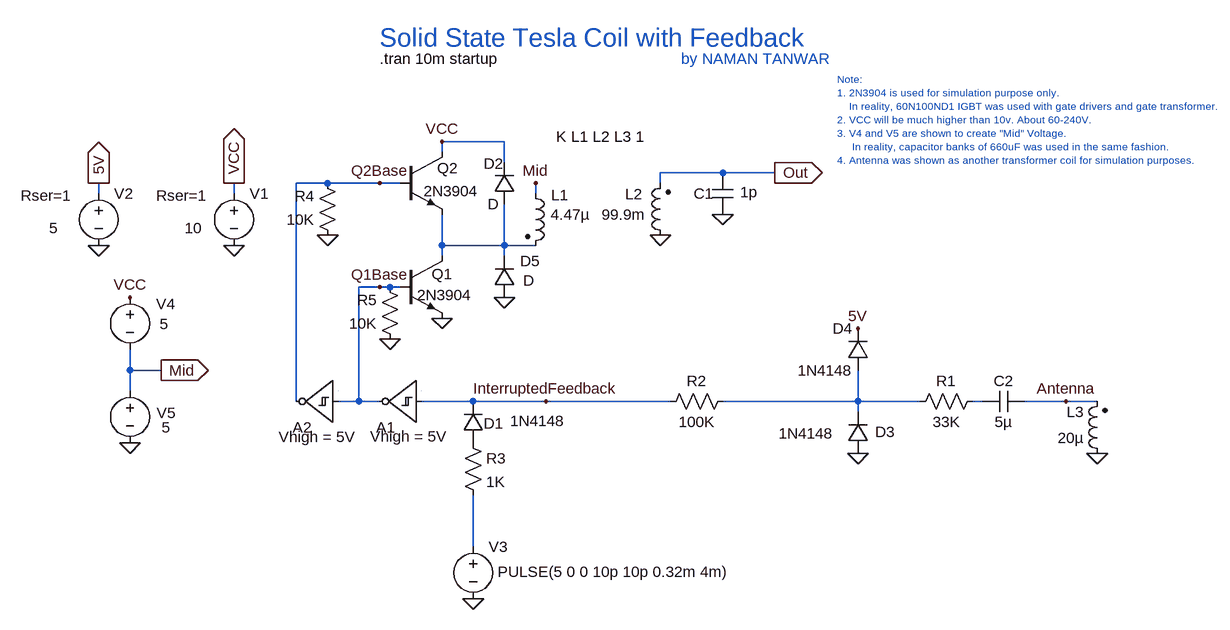
[diagram p0: schematic Feedback tesla coil.asc]
Feedback tesla coil.asc, the LTspice schematic file:
Version 4
SHEET 1 2112 932
WIRE 80 16 -16 16
WIRE -16 32 -16 16
WIRE 80 48 80 16
WIRE 416 64 320 64
WIRE 496 64 416 64
WIRE -192 80 -240 80
WIRE -112 80 -192 80
WIRE -80 80 -112 80
WIRE 320 80 320 64
WIRE -544 96 -544 80
WIRE -336 96 -336 80
WIRE 128 96 128 80
WIRE -16 176 -16 128
WIRE 80 176 80 112
WIRE 80 176 -16 176
WIRE 128 176 80 176
WIRE -16 192 -16 176
WIRE 80 192 80 176
WIRE -112 240 -144 240
WIRE -96 240 -112 240
WIRE -80 240 -96 240
WIRE -496 368 -496 336
WIRE -448 368 -496 368
WIRE -496 400 -496 368
WIRE -240 416 -240 80
WIRE -144 416 -144 240
WIRE -144 416 -176 416
WIRE -112 416 -144 416
WIRE 32 416 -48 416
WIRE 144 416 32 416
WIRE 336 416 144 416
WIRE 624 416 624 368
WIRE 624 416 416 416
WIRE 720 416 624 416
WIRE 816 416 800 416
WIRE 944 416 880 416
WIRE 992 416 944 416
WIRE 624 432 624 416
WIRE 32 640 32 560
FLAG -336 176 0
FLAG -16 288 0
FLAG 416 128 0
FLAG 320 160 0
FLAG 992 496 0
FLAG -336 80 VCC
IOPIN -336 80 Out
FLAG -16 16 VCC
FLAG 624 496 0
FLAG 624 304 5V
FLAG -544 176 0
FLAG -544 80 5V
IOPIN -544 80 Out
FLAG 32 720 0
FLAG -496 256 VCC
FLAG -496 480 0
FLAG -448 368 Mid
IOPIN -448 368 Out
FLAG 128 80 Mid
FLAG 496 64 Out
IOPIN 496 64 Out
FLAG -112 80 Q2Base
FLAG -112 240 Q1Base
FLAG 944 416 Antenna
FLAG 144 416 InterruptedFeedback
FLAG -192 160 0
FLAG -96 320 0
FLAG 80 256 0
SYMBOL voltage -336 80 R0
WINDOW 3 -76 69 Left 2
WINDOW 123 0 0 Left 0
WINDOW 39 -120 19 Left 2
SYMATTR Value 10
SYMATTR SpiceLine Rser=1
SYMATTR InstName V1
SYMBOL ind2 112 80 R0
WINDOW 0 40 18 Left 2
WINDOW 3 39 48 Left 2
SYMATTR InstName L1
SYMATTR Value 4.47µ
SYMATTR Type ind
SYMBOL ind2 336 176 R180
WINDOW 0 43 79 Left 2
WINDOW 3 39 48 Left 2
SYMATTR InstName L2
SYMATTR Value 99.9m
SYMATTR Type ind
SYMBOL npn -80 192 R0
WINDOW 0 48 28 Left 2
WINDOW 3 26 60 Left 2
SYMATTR InstName Q1
SYMATTR Value 2N3904
SYMBOL cap 400 64 R0
WINDOW 0 -29 32 Left 2
WINDOW 3 43 30 Left 2
SYMATTR InstName C1
SYMATTR Value 1p
SYMBOL ind2 1008 512 R180
WINDOW 0 36 80 Left 2
WINDOW 3 36 40 Left 2
SYMATTR InstName L3
SYMATTR Value 20µ
SYMATTR Type ind
SYMBOL npn -80 32 R0
WINDOW 0 57 25 Left 2
WINDOW 3 36 60 Left 2
SYMATTR InstName Q2
SYMATTR Value 2N3904
SYMBOL Digital\\schmtinv -48 480 R180
WINDOW 3 -40 10 Left 2
SYMATTR Value Vhigh = 5V
SYMATTR InstName A1
SYMBOL Digital\\schmtinv -176 480 R180
WINDOW 3 -27 9 Left 2
SYMATTR Value Vhigh = 5V
SYMATTR InstName A2
SYMBOL cap 880 400 R90
WINDOW 0 0 32 VBottom 2
WINDOW 3 32 32 VTop 2
SYMATTR InstName C2
SYMATTR Value 5µ
SYMBOL res 816 400 R90
WINDOW 0 0 56 VBottom 2
WINDOW 3 32 56 VTop 2
SYMATTR InstName R1
SYMATTR Value 33K
SYMBOL diode 640 496 R180
WINDOW 0 -41 33 Left 2
WINDOW 3 53 31 Left 2
SYMATTR InstName D3
SYMATTR Value 1N4148
SYMATTR Description Zener Diode
SYMATTR Type zener
SYMBOL diode 640 368 R180
WINDOW 0 24 64 Left 2
WINDOW 3 24 0 Left 2
SYMATTR InstName D4
SYMATTR Value 1N4148
SYMATTR Description Zener Diode
SYMATTR Type zener
SYMBOL res 432 400 R90
WINDOW 0 0 56 VBottom 2
WINDOW 3 32 56 VTop 2
SYMATTR InstName R2
SYMATTR Value 100K
SYMBOL voltage -544 80 R0
WINDOW 3 -76 69 Left 2
WINDOW 123 0 0 Left 0
WINDOW 39 -120 19 Left 2
SYMATTR Value 5
SYMATTR SpiceLine Rser=1
SYMATTR InstName V2
SYMBOL voltage 32 624 R0
WINDOW 123 0 0 Left 0
WINDOW 39 0 0 Left 0
WINDOW 3 38 54 Left 2
SYMATTR Value PULSE(5 0 0 10p 10p 0.32m 4m)
SYMATTR InstName V3
SYMBOL diode 48 480 R180
WINDOW 0 -31 30 Left 2
WINDOW 3 -126 34 Left 2
SYMATTR InstName D1
SYMATTR Value 1N4148
SYMBOL res 16 464 R0
SYMATTR InstName R3
SYMATTR Value 1K
SYMBOL voltage -496 240 R0
WINDOW 0 40 26 Left 2
WINDOW 3 46 57 Left 2
WINDOW 123 0 0 Left 0
WINDOW 39 0 0 Left 0
SYMATTR InstName V4
SYMATTR Value 5
SYMBOL voltage -496 384 R0
WINDOW 0 41 50 Left 2
WINDOW 3 49 72 Left 2
WINDOW 123 0 0 Left 0
WINDOW 39 0 0 Left 0
SYMATTR InstName V5
SYMATTR Value 5
SYMBOL res -176 176 R180
WINDOW 0 36 76 Left 2
WINDOW 3 36 40 Left 2
SYMATTR InstName R4
SYMATTR Value 10K
SYMBOL res -80 336 R180
WINDOW 0 36 76 Left 2
WINDOW 3 36 40 Left 2
SYMATTR InstName R5
SYMATTR Value 10K
SYMBOL diode 96 112 R180
WINDOW 0 17 62 Left 2
WINDOW 3 24 0 Left 2
SYMATTR InstName D2
SYMBOL diode 96 256 R180
WINDOW 0 -39 56 Left 2
WINDOW 3 -30 26 Left 2
SYMATTR InstName D5
TEXT -112 -112 Left 2 !.tran 10m startup
TEXT 160 8 Left 2 !K L1 L2 L3 1
TEXT -112 -144 Left 4 ;Solid State Tesla Coil with Feedback
TEXT 352 -112 Left 2 ;by NAMAN TANWAR
TEXT 592 -80 Left 1 ;Note:\n1. 2N3904 is used for simulation purpose only. \n    In reality, 60N100ND1 IGBT was used with gate drivers and gate transformer.\n2. VCC will be much higher than 10v. About 60-240V.\n3. V4 and V5 are shown to create "Mid" Voltage.\n     In reality, capacitor banks of 660uF was used in the same fashion.\n4. Antenna was shown as another transformer coil for simulation purposes.

The netlist it stands for:
* Feedback tesla coil.asc
V1 VCC 0 10 Rser=1
L1 Mid N001 4.47µ
L2 0 Out 99.9m
Q1 N001 Q1Base 0 0 2N3904
C1 Out 0 1p
L3 0 Antenna 20µ
Q2 VCC Q2Base N001 0 2N3904
A1 InterruptedFeedback 0 0 0 0 Q1Base 0 0 SCHMITT Vhigh = 5V
A2 Q1Base 0 0 0 0 Q2Base 0 0 SCHMITT Vhigh = 5V
C2 Antenna N003 5µ
R1 N003 N002 33K
D3 0 N002 1N4148
D4 N002 5V 1N4148
R2 N002 InterruptedFeedback 100K
V2 5V 0 5 Rser=1
V3 N004 0 PULSE(5 0 0 10p 10p 0.32m 4m)
D1 P001 InterruptedFeedback 1N4148
R3 P001 N004 1K
V4 VCC Mid 5
V5 Mid 0 5
R4 0 Q2Base 10K
R5 0 Q1Base 10K
D2 N001 VCC D
D5 0 N001 D
.model D D
.lib standard.dio
.model NPN NPN
.model PNP PNP
.lib standard.bjt
.tran 10m startup
K L1 L2 L3 1
* Solid State Tesla Coil with Feedback
* by NAMAN TANWAR
* Note:
* 1. 2N3904 is used for simulation purpose only.
*     In reality, 60N100ND1 IGBT was used with gate drivers and gate transformer.
* 2. VCC will be much higher than 10v. About 60-240V.
* 3. V4 and V5 are shown to create "Mid" Voltage.
*      In reality, capacitor banks of 660uF was used in the same fashion.
* 4. Antenna was shown as another transformer coil for simulation purposes.
.backanno
.end